# Altium schematic sheet SC10033E1_4.SchDoc
size A4
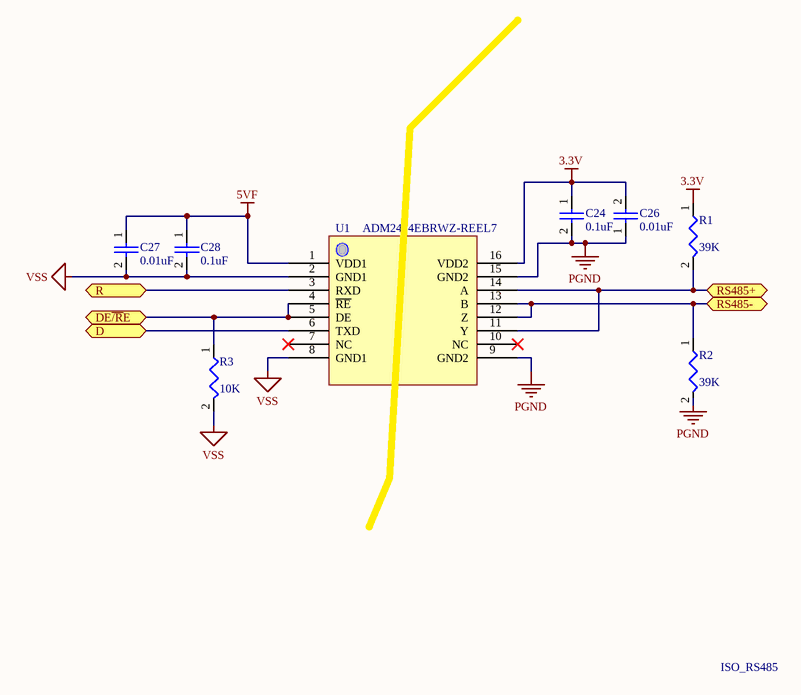
[diagram p0: SC10033E1_4.SchDoc]

## Parts
C24  value 0.1uF  [C0805]  (hidden comment: CAP)
C26  value 0.01uF  [C0805]  (hidden comment: CAP)
C27  value 0.01uF  [C0805]  (hidden comment: CAP)
C28  value 0.1uF  [C0805]  (hidden comment: CAP)
R1  value 39K  [R0805]  (hidden comment: RES)
R2  value 39K  [R0805]  (hidden comment: RES)
R3  value 10K  [R0805]  (hidden comment: RES)
U1  value ADM2484EBRWZ-REEL7  [SOIC16]  (hidden comment: ADM2484E)

## Ports
D, DE~{/R}E, R, RS485+, RS485-

## Nets
3.3V: C24.1 C26.2 R1.1 U1.16(VDD2)
5VF: C27.1 C28.1 U1.1(VDD1)
PGND: C24.2 C26.1 R2.2 U1.9(GND2) U1.15(GND2)
VSS: C27.2 C28.2 R3.2 U1.2(GND1) U1.8(GND1)
D: U1.6(TXD) ; port D
DE~{/R}E: R3.1 U1.4(~{RE}) U1.5(DE) ; port DE~{/R}E
R: U1.3(RXD) ; port R
RS485+: R1.2 U1.11(Y) U1.14(A) ; port RS485+
RS485-: R2.1 U1.12(Z) U1.13(B) ; port RS485-

Not connected (* = marked no-connect by the designer): U1 7(NC)* 10(NC)*

## Notes on the sheet
- ISO_RS485

## Library data of the parts
C24 C28 = EC00014: CAP SMD CR X7R 50V 10% 0.1uF 0805 ROHS; Manufacturer: YAGEO; Manufacturer P/N: CC0805KRX7R9BB104; ID: 14; HelpURL: *; P/N: EC00014
C26 C27 = EC00037: CAP SMD X7R 50V 10% 10nF 0805 ROHS; Manufacturer: YAGEO; Manufacturer P/N: CC0805KRX7R9BB103; ID: 37; HelpURL: *; P/N: EC00037
R1 R2 = ER00021: RES THICK_FILM SMD 39K 5% 1/8W ROHS 0805; Manufacturer: YAGEO; Manufacturer P/N: RC0805JR-0739KL; ID: 21; HelpURL: *; P/N: ER00021
R3 = ER00031: RES THICK_FILM SMD 10K 5% 1/8W ROHS 0805; Manufacturer: YAGEO; Manufacturer P/N: RC0805JR-0710KL; ID: 31; HelpURL: *; P/N: ER00031
U1 = EU00059: IC Isolated, RS-485/RS-422 transceiver,5kV,SOIC16_W,ROHS; Manufacturer: Analog Devices; Pin Number: 16; ID: 59; HelpURL: \\192.168.1.3\Esh\Department\RD\CAD\Component\RS485\ADM2484E.pdf; P/N: EU00059; Manufacturer P/N: ADM2484EBRWZ-REEL7; Type: *****